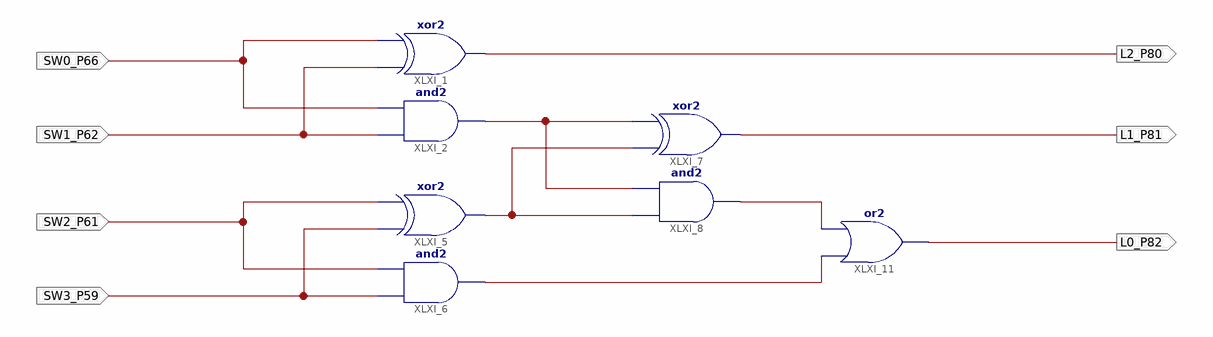
[diagram p0: schematic sheet 1]
// Xilinx ISE schematic Lab4.sch (spartan6) as structural Verilog: 7 symbols, 7 ports
module Lab4 (
  input  SW0_P66,
  input  SW1_P62,
  input  SW2_P61,
  input  SW3_P59,
  output L2_P80,
  output L1_P81,
  output L0_P82
);

  wire XLXN_10, XLXN_16, XLXN_19, XLXN_21;

  xor XLXI_1 (L2_P80, SW1_P62, SW0_P66);
  and XLXI_2 (XLXN_10, SW1_P62, SW0_P66);
  xor XLXI_5 (XLXN_16, SW3_P59, SW2_P61);
  and XLXI_6 (XLXN_21, SW3_P59, SW2_P61);
  xor XLXI_7 (L1_P81, XLXN_16, XLXN_10);
  and XLXI_8 (XLXN_19, XLXN_16, XLXN_10);
  or XLXI_11 (L0_P82, XLXN_21, XLXN_19);
endmodule
